# EAGLE schematic plat_4pinTo40pin (EAGLE 5.11)
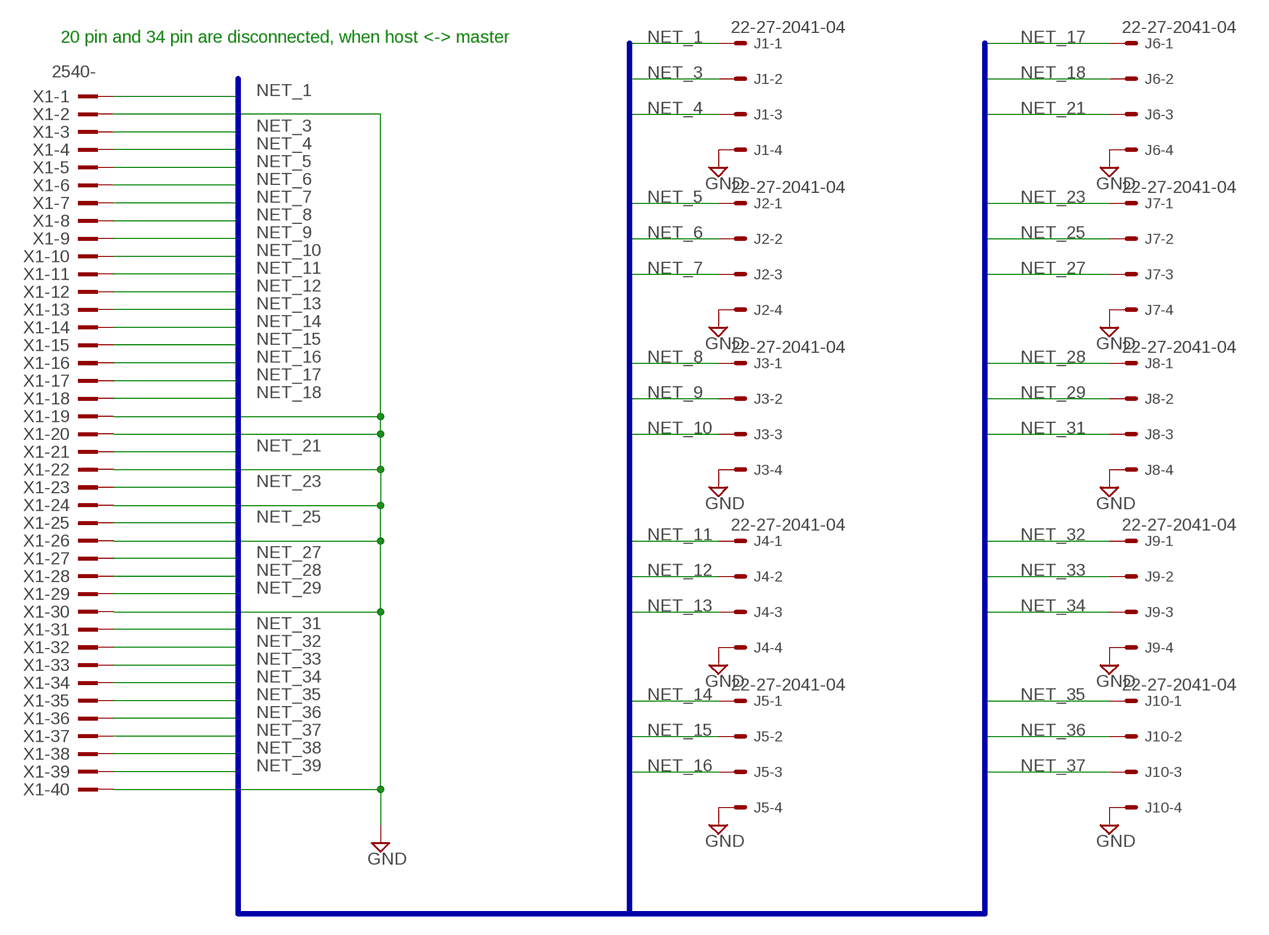
[diagram p0: schematic, sheet 1]

## Parts
J1  22-27-2041-04  [6410-04]
J2  22-27-2041-04  [6410-04]
J3  22-27-2041-04  [6410-04]
J4  22-27-2041-04  [6410-04]
J5  22-27-2041-04  [6410-04]
J6  22-27-2041-04  [6410-04]
J7  22-27-2041-04  [6410-04]
J8  22-27-2041-04  [6410-04]
J9  22-27-2041-04  [6410-04]
J10  22-27-2041-04  [6410-04]
X1  2540-  [PAK100/2500-40]

## Nets
GND: J1.4 J2.4 J3.4 J4.4 J5.4 J6.4 J7.4 J8.4 J9.4 J10.4 X1.2 X1.19 X1.20 X1.22 X1.24 X1.26 X1.30 X1.40
NET_1: J1.1 X1.1
NET_3: J1.2 X1.3
NET_4: J1.3 X1.4
NET_5: J2.1 X1.5
NET_6: J2.2 X1.6
NET_7: J2.3 X1.7
NET_8: J3.1 X1.8
NET_9: J3.2 X1.9
NET_10: J3.3 X1.10
NET_11: J4.1 X1.11
NET_12: J4.2 X1.12
NET_13: J4.3 X1.13
NET_14: J5.1 X1.14
NET_15: J5.2 X1.15
NET_16: J5.3 X1.16
NET_17: J6.1 X1.17
NET_18: J6.2 X1.18
NET_21: J6.3 X1.21
NET_23: J7.1 X1.23
NET_25: J7.2 X1.25
NET_27: J7.3 X1.27
NET_28: J8.1 X1.28
NET_29: J8.2 X1.29
NET_31: J8.3 X1.31
NET_32: J9.1 X1.32
NET_33: J9.2 X1.33
NET_34: J9.3 X1.34
NET_35: J10.1 X1.35
NET_36: J10.2 X1.36
NET_37: J10.3 X1.37
NET_38: X1.38
NET_39: X1.39

## Buses
NET_[1..40]

## Notes on the sheet
- 20 pin and 34 pin are disconnected, when host <-> master

## Library data of the parts
J1-J10 = con-molex:22-?-04: CONNECTOR wire to board 2.54 mm (.1 inch) pitch header; OC_FARNELL: unknown; OC_NEWARK: unknown
X1 = con-3m:2540-: 3M (TM) Pak 100 4-Wall Header Source: 3M; OC_FARNELL: unknown; OC_NEWARK: unknown